# EAGLE design powersupply (EAGLE 9.0.0)
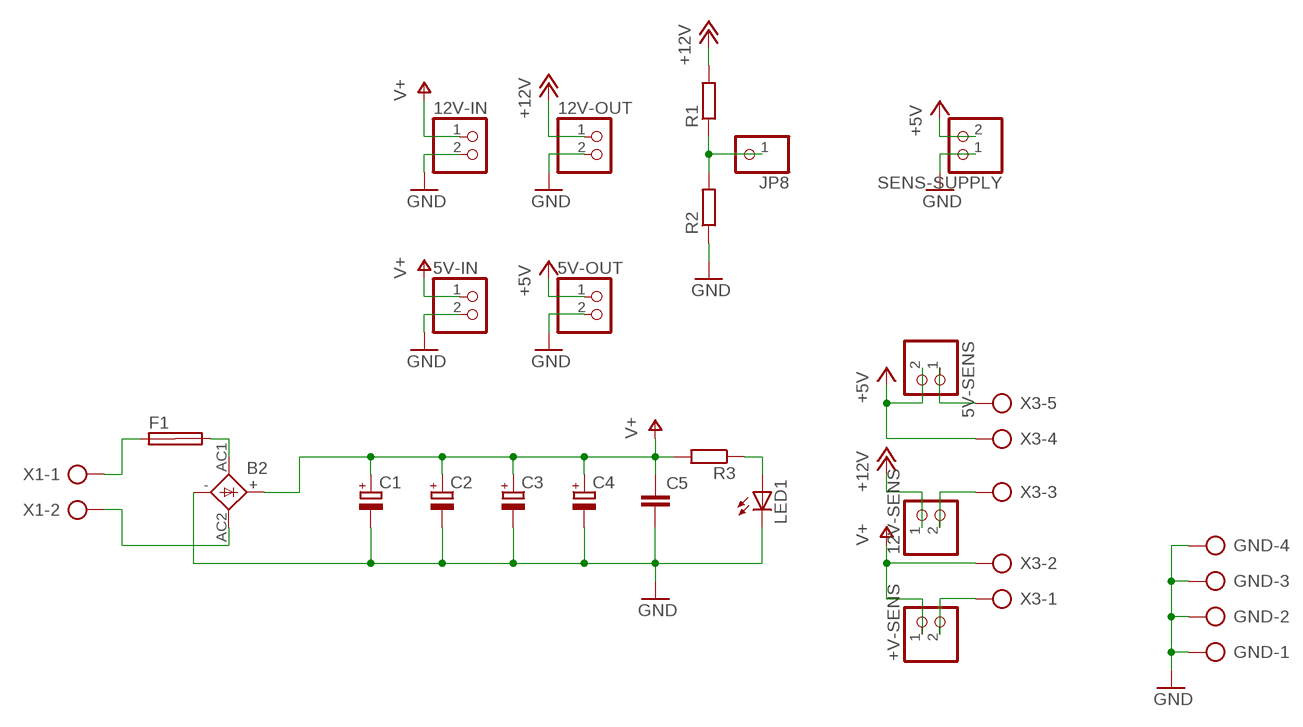
[diagram p0: schematic, sheet 1]

## Parts
5V-IN  PINHD-1X2  [1X02]
5V-OUT  PINHD-1X2  [1X02]
5V-SENS  PINHD-1X2  [1X02]
12V-IN  PINHD-1X2  [1X02]
12V-OUT  PINHD-1X2  [1X02]
12V-SENS  PINHD-1X2  [1X02]
+V-SENS  PINHD-1X2  [1X02]
B2  FB32  [FB32]
C1  CPOL-EUE5-13  [E5-13]
C2  CPOL-EUE5-13  [E5-13]
C3  CPOL-EUE5-13  [E5-13]
C4  CPOL-EUE5-13  [E5-13]
C5  C-EU025-025X050  [C025-025X050]
F1  SHK20L  [SHK20L]
GND  AK300/4  [AK300/4]
JP8  PINHD-1X1  [1X01]
LED1  LEDB152  [Q62902-B152]
R1  R-EU_R1206  [R1206]
R2  R-EU_R1206  [R1206]
R3  R-EU_R1206  [R1206]
SENS-SUPPLY  PINHD-1X2  [1X02]
X1  AK300/2  [AK300/2]
X3  AK300/5  [AK300/5]

## Nets
12V-SENS: 12V-SENS.2 X3.3
+5V: 5V-OUT.1 5V-SENS.2 SENS-SUPPLY.2 X3.4
+12V: 12V-OUT.1 12V-SENS.1 R1.2
GND: 5V-IN.2 5V-OUT.2 12V-IN.2 12V-OUT.2 B2.- C1.- C2.- C3.- C4.- C5.2 GND.1 GND.2 GND.3 GND.4 LED1.K(C) R2.1 SENS-SUPPLY.1
N$1: F1.1A X1.1
N$2: B2.AC1 F1.2A
N$3: B2.AC2 X1.2
N$4: +V-SENS.2 X3.1
N$5: 5V-SENS.1 X3.5
N$7: LED1.A R3.1
N$8: JP8.1 R1.1 R2.2
V+: 5V-IN.1 12V-IN.1 +V-SENS.1 B2.+ C1.+ C2.+ C3.+ C4.+ C5.1 R3.2 X3.2
Unconnected: F1.1B F1.2B

## Library data of the parts
5V-IN 5V-OUT 5V-SENS 12V-IN 12V-OUT 12V-SENS +V-SENS SENS-SUPPLY = pinhead:PINHD-1X2: PIN HEADER
B2 = rectifier:FB32: FAGOR RECTIFIER grid 1 x 10,2 x 7,5 mm
C1-C4 = rcl:CPOL-EU: POLARIZED CAPACITOR, European symbol; SPICEPREFIX: C
C5 = rcl:C-EU: CAPACITOR, European symbol; SPICEPREFIX: C
F1 = fuse:SHK20L: FUSE HOLDER 5 x 20 mm, SH contact, SHH1 Schukat, E1073 Buerklin; OC_FARNELL: unknown; OC_NEWARK: unknown
GND = con-ptr500:AK300/4: CONNECTOR; OC_FARNELL: unknown; OC_NEWARK: unknown
JP8 = pinhead:PINHD-1X1: PIN HEADER
LED1 = led:LED: LED OSRAM: - CHIPLED LG R971, LG N971, LY N971, LG Q971, LY Q971, LO R971, LY R971 LH N974, LH R974 LS Q976, LO Q976, LY Q976 LO Q996 - Hyper CHIPLED LW Q18S LB Q993, LB Q99A, LB R99A - SideLED LS A670, LO A670, LY A670, LG A670, LP A670 LB A673, LV A673, LT A673, LW A673 LH A674 LY A675 LS A676, LA A676, LO A676, LY A676, LW A676 LS A679, LY A679, LG A679 - Hyper Micro SIDELED® LS Y876, LA Y876, LO Y876, LY Y876 LT Y87S - SmartLED LW L88C, LW L88S LB L89C, LB L89S, LG L890 LS L89K, LO L89K, LY L89K LS L896, LA L896, LO L896, LY L896 - TOPLED LS T670, LO T670, LY T670, LG T670, LP T670 LSG T670, LSP T670, LSY T670, LOP T670, LYG T670 LG T671, LOG T671, LSG T671 LB T673, LV T673, LT T673, LW T673 LH T674 LS T676, LA T676, LO T676, LY T676, LB T676, LH T676, LSB T676, LW T676 LB T67C, LV T67C, LT T67C, LS T67K, LO T67K, LY T67K, LW E67C LS E67B, LA E67B, LO E67B, LY E67B, LB E67C, LV E67C, LT E67C LW T67C LS T679, LY T679, LG T679 LS T770, LO T770, LY T770, LG T770, LP T770 LB T773, LV T773, LT T773, LW T773 LH T774 LS E675, LA E675, LY E675, LS T675 LS T776, LA T776, LO T776, LY T776, LB T776 LHGB T686 LT T68C, LB T68C - Hyper Mini TOPLED® LB M676 - Mini TOPLED Santana® LG M470 LS M47K, LO M47K, LY M47K Source: http://www.osram.convergy.de LUXEON: - LUMILED® LXK2-PW12-R00, LXK2-PW12-S00, LXK2-PW14-U00, LXK2-PW14-V00 LXK2-PM12-R00, LXK2-PM12-S00, LXK2-PM14-U00 LXK2-PE12-Q00, LXK2-PE12-R00, LXK2-PE12-S00, LXK2-PE14-T00, LXK2-PE14-U00 LXK2-PB12-K00, LXK2-PB12-L00, LXK2-PB12-M00, LXK2-PB14-N00, LXK2-PB14-P00, LXK2-PB14-Q00 LXK2-PR12-L00, LXK2-PR12-M00, LXK2-PR14-Q00, LXK2-PR14-R00 LXK2-PD12-Q00, LXK2-PD12-R00, LXK2-PD12-S00 LXK2-PH12-R00, LXK2-PH12-S00 LXK2-PL12-P00, LXK2-PL12-Q00, LXK2-PL12-R00 Source: www.luxeon.com KINGBRIGHT: KA-3528ASYC Source: www.kingbright.com
R1-R3 = rcl:R-EU_: RESISTOR, European symbol; SPICEPREFIX: R
X1 = con-ptr500:AK300/2: CONNECTOR; OC_FARNELL: unknown; OC_NEWARK: unknown
X3 = con-ptr500:AK300/5: CONNECTOR; OC_FARNELL: unknown; OC_NEWARK: unknown

## Board
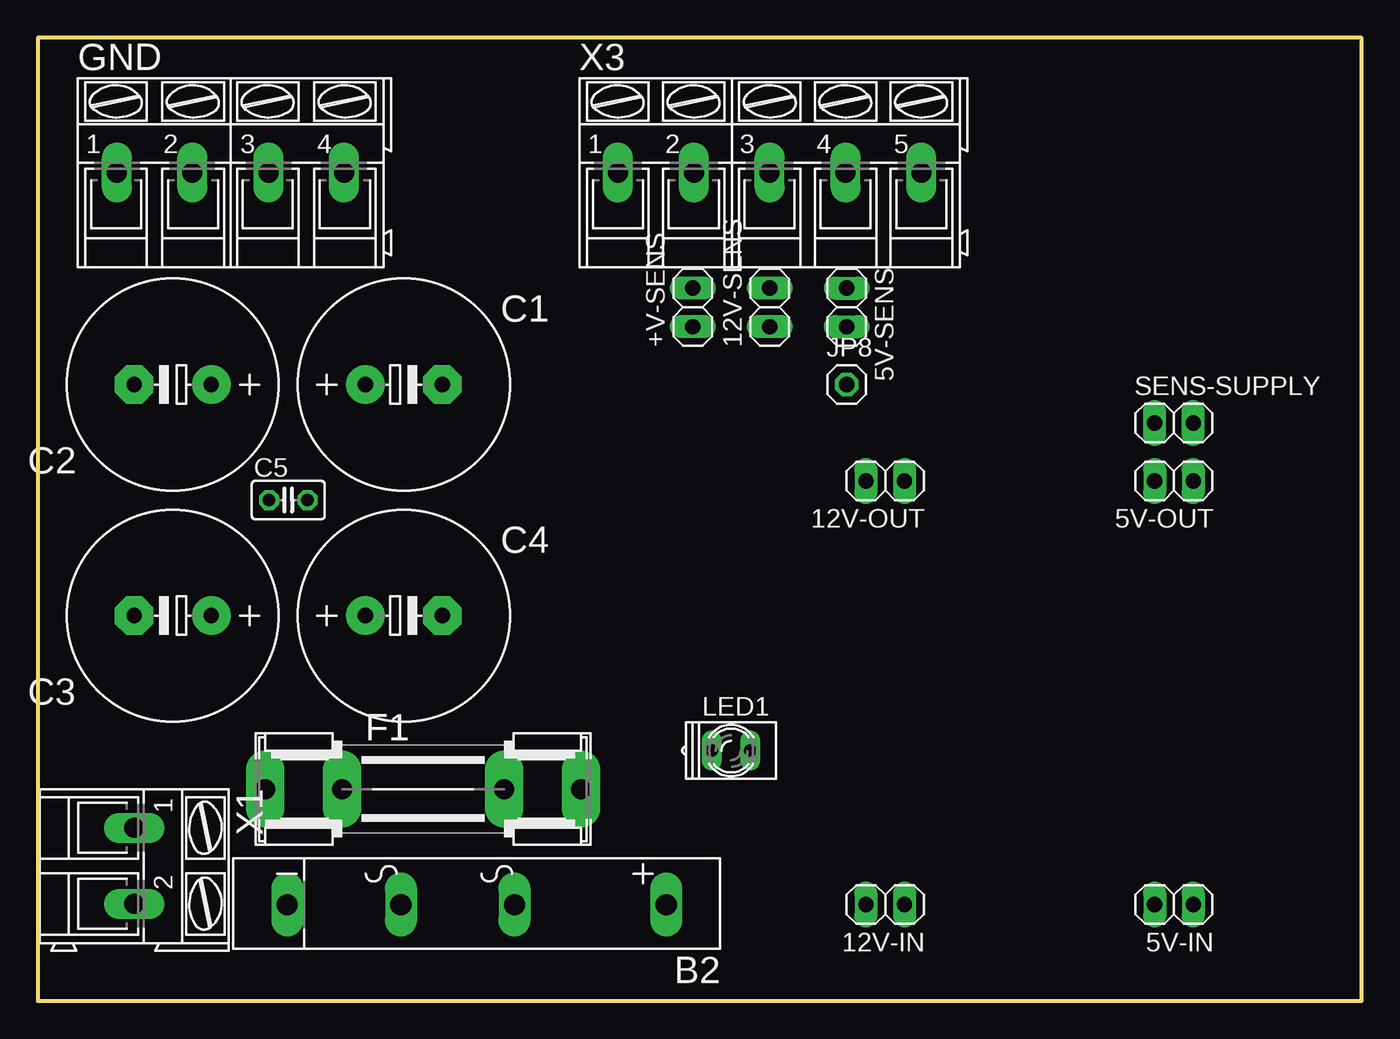
[diagram p1: board, top side]
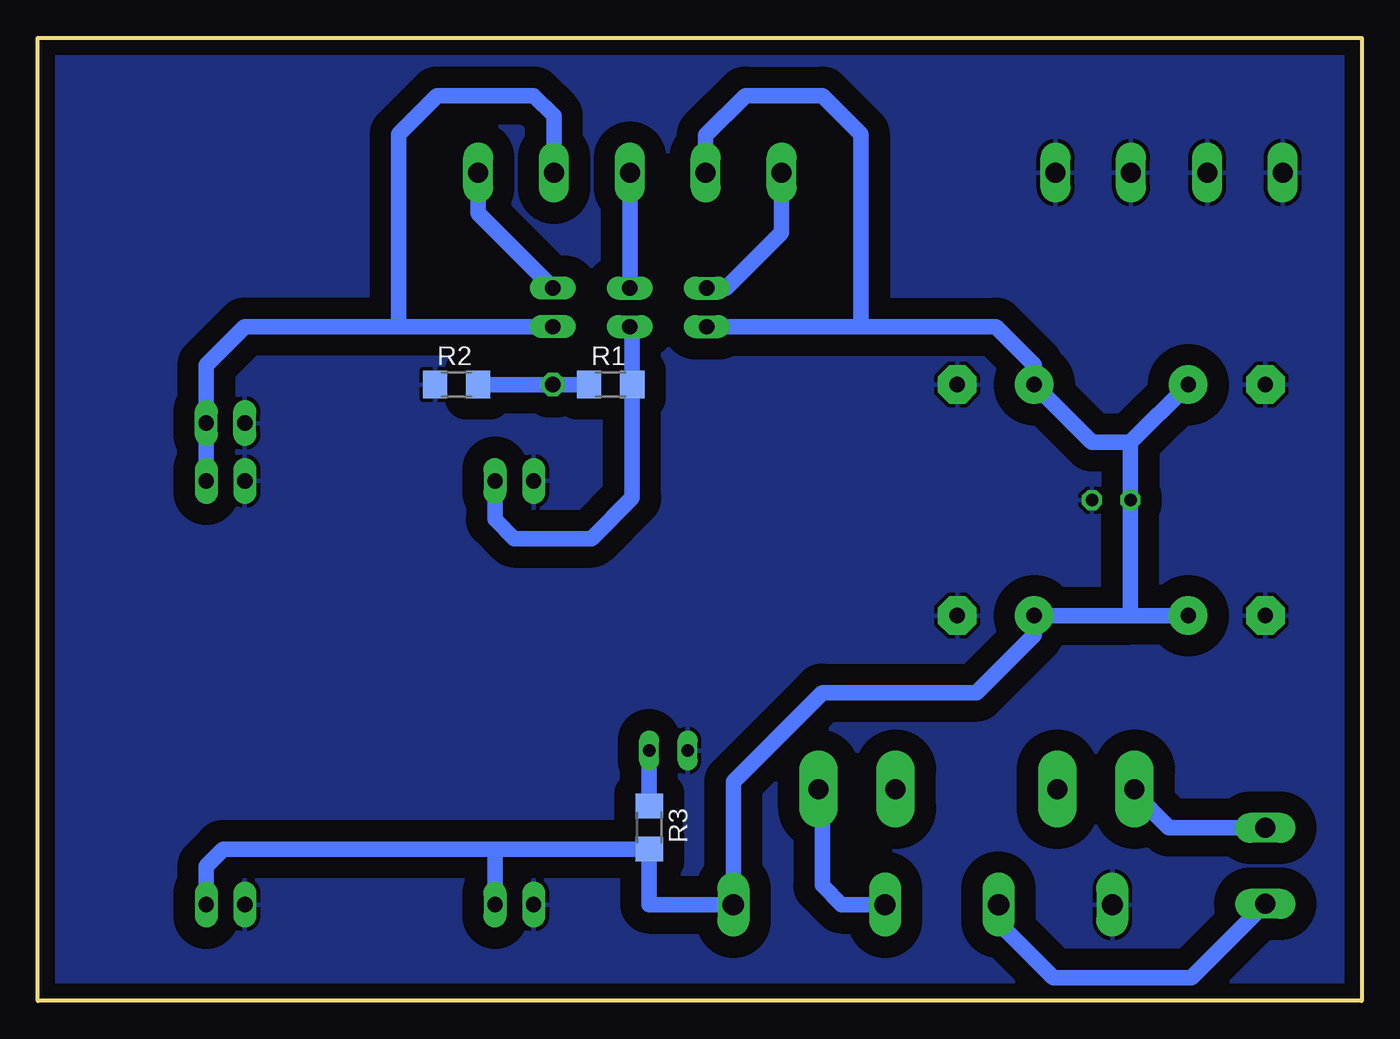
[diagram p2: board, bottom side, seen from below]

Size 87.3 x 63.49 mm. Coordinates in mm from the lower left corner, seen from the top.
Outline: 0,0 87.3,0 87.3,63.49 0,63.49 0,0
Copper layers (1*16): Top 0.035mm / dielectric 1.5mm / Bottom 0.035mm
Design rules "default *": minimum track width 6mil, minimum drill 0.35mm, track to track 1.4mm, track to pad 1.4mm, pad to pad 6mil, via to via 6mil, smd to smd 6mil, copper to edge 40mil, drill to drill 6mil, minimum pad ring 10mil, minimum via ring 8mil, stop-mask expansion 4mil, vias tented up to drill 0mil, thermal gap 10mil

### Footprints (pad centres in the part's own frame; a part is rotated, then mirrored left to right if it is on the bottom)
1X02 = drill 1.016 long: 1 -1.27,0; 2 1.27,0
FB32 = drill 1.397 long: + -13.5,0; - 11.494,0; AC1 -3.492,0; AC2 4.001,0
E5-13 = drill 1.016 pad 2.54: + -2.54,0 | drill 1.016 pad 2.54 octagon: - 2.54,0
C025-025X050 = drill 0.813 octagon: 1 -1.27,0; 2 1.27,0
SHK20L = drill 1.321 pad 2.54 long: 1A -10.414,0; 1B -5.334,0; 2A 10.414,0; 2B 5.334,0
AK300/4 = drill 1.321 long: 1 -7.493,0; 2 -2.515,0; 3 2.515,0; 4 7.493,0
1X01 = drill 1.016 octagon: 1 0,0
Q62902-B152 = drill 0.813 long: A 1.27,0; K -1.27,0
R1206 = smd 1.6 x 1.803: 1 -1.422,0; 2 1.422,0
AK300/2 = drill 1.321 long: 1 -2.515,0; 2 2.489,0
AK300/5 = drill 1.321 long: 1 -10.008,0; 2 -5.004,0; 3 0,0; 4 5.004,0; 5 10.008,0

### Placement (x,y rotation side)
5V-IN  74.93,6.35 180 top
5V-OUT  74.93,34.29 180 top
5V-SENS  53.34,45.72 270 top
12V-IN  55.88,6.35 180 top
12V-OUT  55.88,34.29 180 top
12V-SENS  48.26,45.72 90 top
+V-SENS  43.18,45.72 90 top
B2  27.94,6.35 180 top
C1  24.13,40.64 0 top
C2  8.89,40.64 180 top
C3  8.89,25.4 180 top
C4  24.13,25.4 0 top
C5  16.51,33.02 0 top
F1  25.4,13.97 0 top
GND  12.7,54.61 0 top
JP8  53.34,40.64 0 top
LED1  45.72,16.51 0 top
R1  49.53,40.64 0 bottom
R2  59.69,40.64 0 bottom
R3  46.99,11.43 270 bottom
SENS-SUPPLY  74.93,38.1 0 top
X1  6.35,8.89 270 top
X3  48.26,54.61 0 top

### Tracks (layer width: path | path; a pad name or v marks a point on that pad's centre or on a via)
12V-SENS
  Bottom 1.016: 12V-SENS.2 X3.3
+5V
  Bottom 1.016: 5V-SENS.2 63.5,44.45 | 63.5,44.45 73.66,44.45 76.2,41.91 SENS-SUPPLY.2 5V-OUT.1 | X3.4 53.26,58.34 54.61,59.69 60.96,59.69 63.5,57.15 63.5,44.45
+12V
  Bottom 1.016: 12V-SENS.1 48.11,44.3 R1.2 48.11,33.17 50.8,30.48 55.88,30.48 57.15,31.75 12V-OUT.1
GND
  pour Bottom: 0,0 87.63,0 87.63,63.5 0,63.5
N$1
  Bottom 1.016: X1.1 6.38,11.43 12.7,11.43 14.99,13.72 F1.1A
N$2
  Bottom 1.016: F1.2A 35.56,13.72 35.56,7.62 34.29,6.35 B2.AC1
N$3
  Bottom 1.016: X1.2 11.23,1.52 20.32,1.52 23.94,5.14 B2.AC2
N$4
  Bottom 1.016: X3.1 38.25,50.65 41.91,46.99 +V-SENS.2
N$5
  Bottom 1.016: 5V-SENS.1 58.27,51.92 X3.5
N$7
  Bottom 1.016: R3.1 LED1.A
N$8
  Bottom 1.016: R1.1 JP8.1 R2.2
V+
  Bottom 1.016: 15.24,25.4 C5.1 15.24,36.83 | 15.24,25.4 C4.+ 21.59,24.13 25.4,20.32 35.56,20.32 41.44,14.44 B2.+ 46.99,6.35 R3.2 57.15,10.01 | C3.+ 15.24,25.4 | C2.+ 15.24,36.83 | 15.24,36.83 17.78,36.83 C1.+ 21.59,41.91 24.13,44.45 33.02,44.45 | +V-SENS.1 33.02,44.45 | 12V-IN.1 57.15,10.01 | 5V-IN.1 76.2,8.89 75.08,10.01 57.15,10.01 | X3.2 43.26,57.07 40.64,59.69 35.56,59.69 33.02,57.15 33.02,44.45